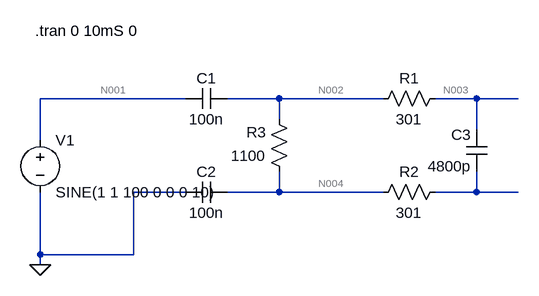
[diagram p0: schematic pwm-highpass.asc]
pwm-highpass.asc, the LTspice schematic file:
Version 4
SHEET 1 980 680
WIRE 400 240 176 240
WIRE 544 240 464 240
WIRE 704 240 544 240
WIRE 848 240 784 240
WIRE 912 240 848 240
WIRE 544 272 544 240
WIRE 848 288 848 240
WIRE 176 304 176 240
WIRE 400 384 320 384
WIRE 544 384 544 352
WIRE 544 384 464 384
WIRE 704 384 544 384
WIRE 848 384 848 352
WIRE 848 384 784 384
WIRE 912 384 848 384
WIRE 176 480 176 384
WIRE 320 480 320 384
WIRE 320 480 176 480
WIRE 176 496 176 480
FLAG 176 496 0
SYMBOL voltage 176 288 R0
SYMATTR InstName V1
SYMATTR Value SINE(1 1 100 0 0 0 10)
SYMBOL res 800 224 R90
WINDOW 0 0 56 VBottom 2
WINDOW 3 32 56 VTop 2
SYMATTR InstName R1
SYMATTR Value 301
SYMBOL res 800 368 R90
WINDOW 0 0 56 VBottom 2
WINDOW 3 32 56 VTop 2
SYMATTR InstName R2
SYMATTR Value 301
SYMBOL res 560 368 R180
WINDOW 0 36 76 Left 2
WINDOW 3 36 40 Left 2
SYMATTR InstName R3
SYMATTR Value 1100
SYMBOL cap 464 224 R90
WINDOW 0 0 32 VBottom 2
WINDOW 3 32 32 VTop 2
SYMATTR InstName C1
SYMATTR Value 100n
SYMBOL cap 464 368 R90
WINDOW 0 0 32 VBottom 2
WINDOW 3 32 32 VTop 2
SYMATTR InstName C2
SYMATTR Value 100n
SYMBOL cap 864 352 R180
WINDOW 0 24 56 Left 2
WINDOW 3 24 8 Left 2
SYMATTR InstName C3
SYMATTR Value 4800p
TEXT 168 136 Left 2 !.tran 0 10mS 0

The netlist it stands for:
* pwm-highpass.asc
V1 N001 0 SINE(1 1 100 0 0 0 10)
R1 N003 N002 301
R2 N005 N004 301
R3 N004 N002 1100
C1 N002 N001 100n
C2 N004 0 100n
C3 N005 N003 4800p
.tran 0 10mS 0
.backanno
.end

* Results of the author's LTspice run, read from the files saved beside the schematic
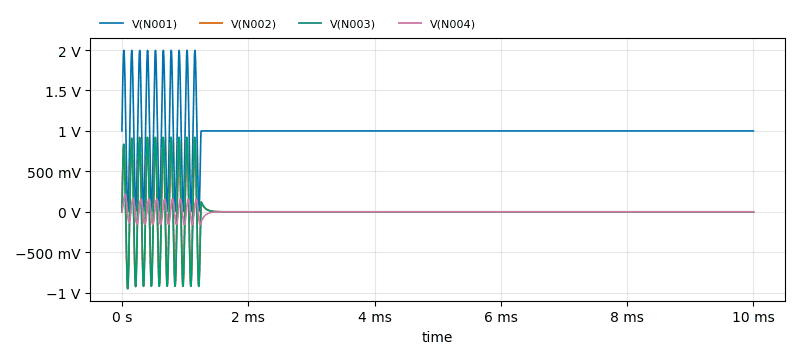
[diagram p1: Transient Analysis of pwm-highpass.asc, plotted from the saved traces]
* Transient Analysis, 1 run:
*   V(N001): min 5.482 mV, max 1.996 V, average 999.9 mV, rms 1.03 V, last 1 V
*   V(N002): min -947.9 mV, max 918 mV, average -34.97 µV, rms 227 mV, last 100 nV
*   V(N003): min -951.7 mV, max 920.7 mV, average -32.97 µV, rms 227.9 mV, last 100 nV
*   V(N004): min -156.1 mV, max 218.9 mV, average -15.87 µV, rms 41.52 mV, last 100 nV